# Altium schematic sheet Hero_Chassis_v1.0.SchDoc
size A4
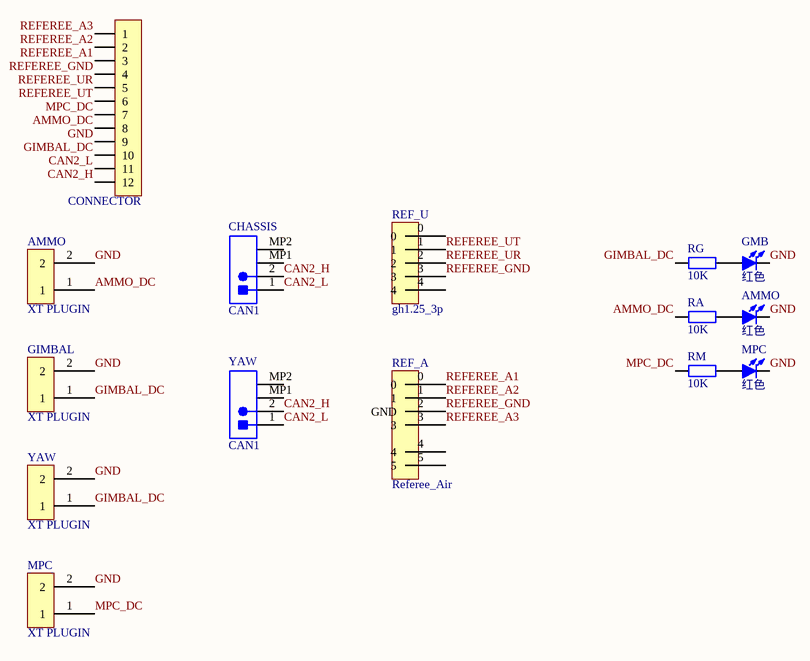
[diagram p0: Hero_Chassis_v1.0.SchDoc]

## Parts
(Parts that share a designator on the sheet are numbered #1, #2 ... from top to bottom, then left to right.)
AMMO#1  XT PLUGIN  [XT30-M]
AMMO#2  红色  [LED 0805G]
CHASSIS  CAN1  [JST-BM02B-GHS-TBT_V]
CONNECTOR  HDR-1X12  [KF2EDGK5.08-LI-12P]  (value not drawn)
GIMBAL  XT PLUGIN  [XT30-M]
GMB  红色  [LED 0805G]
MPC#1  红色  [LED 0805G]
MPC#2  XT PLUGIN  [XT30-M]
RA  10K  [R 0805_L]
REF_A  Referee_Air  [M8 Connector]
REF_U  gh1.25_3p  [GH1.25-LS-3P]
RG  10K  [R 0805_L]
RM  10K  [R 0805_L]
YAW#1  CAN1  [JST-BM02B-GHS-TBT_V]
YAW#2  XT PLUGIN  [XT30-M]

## Nets
AMMO_DC: AMMO#1.1 CONNECTOR.8 RA.1
CAN2_H: CHASSIS.2 CONNECTOR.12 YAW#1.2
CAN2_L: CHASSIS.1 CONNECTOR.11 YAW#1.1
GIMBAL_DC: CONNECTOR.10 GIMBAL.1 RG.1 YAW#2.1
GND: AMMO#1.2 AMMO#2.2(K) CONNECTOR.9 GIMBAL.2 GMB.2(K) MPC#1.2(K) MPC#2.2 YAW#2.2
MPC_DC: CONNECTOR.7 MPC#2.1 RM.1
REFEREE_A1: CONNECTOR.3 REF_A.0
REFEREE_A2: CONNECTOR.2 REF_A.1
REFEREE_A3: CONNECTOR.1 REF_A.3
REFEREE_GND: CONNECTOR.4 REF_A.2(GND) REF_U.3
REFEREE_UR: CONNECTOR.5 REF_U.2
REFEREE_UT: CONNECTOR.6 REF_U.1
NetAMMO#2_1: AMMO#2.1(A) RA.2
NetGMB_1: GMB.1(A) RG.2
NetMPC#1_1: MPC#1.1(A) RM.2

Not connected (* = marked no-connect by the designer): CHASSIS MP1 MP2; REF_A 4 5; REF_U 0 4; YAW#1 MP1 MP2

## Library data of the parts
AMMO#2 GMB MPC#1 = LED-SMD: 贴片LED; 版权归属: 封装库来自淘宝 ID：黄晶宝石; BOM名称: 贴片LED; 学习资源: https://shop463601444.taobao.com
CHASSIS YAW#1 = CMP-2000-05957-1: Disconnectable Crimp Style Connector, Pitch 1.25 mm, 1 x 2 Position, Height 4.05 mm, -25 to 85 degC, RoHS, Tape and Reel; Manufacturer: JST-Sales-America-Inc.; Connector Type: Header,Shrouded; Number of Positions Loaded: All; Pitch: 0.049"(1.25mm); Number of Positions: 2; Family: RectangularConnectors-Headers,MalePins; Contact Finish: Tin; Contact Type: OuterShroudContact; Number of Rows: 1; Row Spacing: -; Datasheet Version: 05/2016; Fastening Type: LockingRamp; Contact Mating Length: -; Packaging: Digi-Reel®; Manufacturer URL: http://www.jst.com/home2.html; Termination: Solder; Package Description: Disconnectable Crimp Style Connector, Pitch 1.25 mm, 1 x 2 Position, Height 4.05 mm; Features: SolderRetention; Color: Natural; Datasheet URL: http://www.jst-mfg.com/product/pdf/eng/eGH.pdf; Package Reference: BM02B-GHS-TBT; Series: GH; Contact Finish Thickness: -; Mounting Type: SurfaceMount; Mounting Technology: SurfaceMount; Category: Connectors,Interconnects
CONNECTOR = Header 12: 12P接插件; 版权归属: 封装库来自淘宝卖家 ID：黄晶宝石; BOM名称: 12P接插件; 学习资源: https://shop463601444.taobao.com
RA RG RM = R: 贴片电阻; 版权归属: 来自淘宝 ID：黄晶宝石; 封装库来自淘宝卖家 ID：黄晶宝石: 其他店铺购入均为盗版，不享受售后技术支持服务，请立即申请退款; BOM名称: 贴片电阻; 联系售后: https://shop463601444.taobao.com